# Altium schematic sheet Sheet1.SchDoc
size A; SheetNumber: 1; SheetTotal: 1
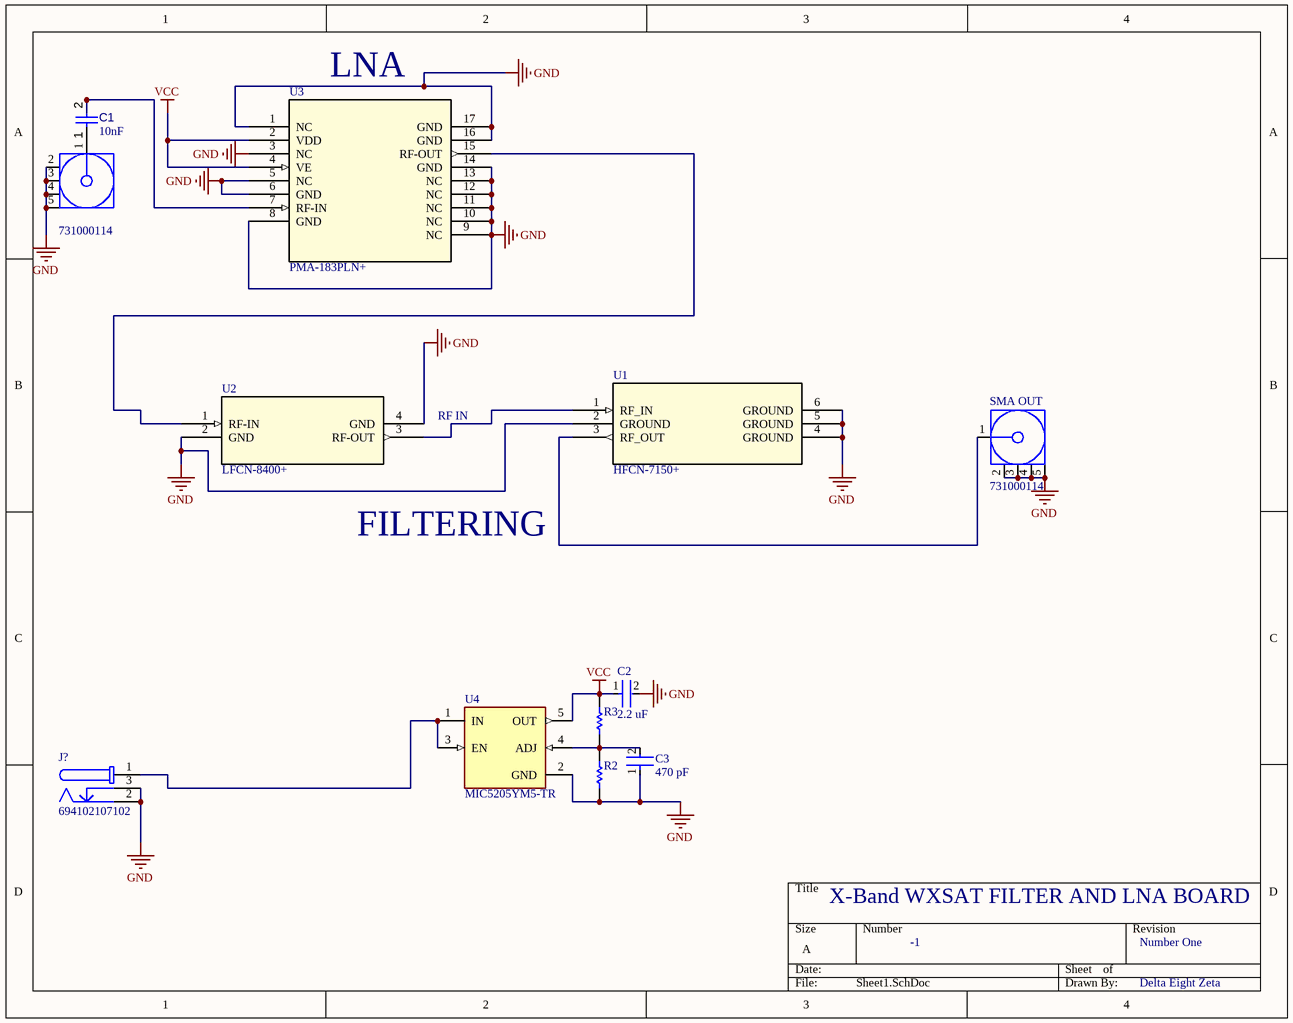
[diagram p0: Sheet1.SchDoc]

## Parts
?  731000114  [MOLX-731000114_V]
C1  value 10nF  [CAPC0402(1005)60_L]  (hidden comment: Capacitor 10nF +/-20% 50V 0402)
C2  2.2 uF  [FP-GRM188-0_1-e0_2_0_5-MFG]
C3  470 pF  [FP-0402-L_1_0_1-W_0_5_0_1-IPC_A]
J?  694102107102  [694102107102]
R2  (no value)  [RESC1005X40X25ML10T10]
R3  (no value)  [RESC2013X60X40LL20T25]
SMA_OUT  731000114  [MOLX-731000114_V]
U1  HFCN-7150+  [FV1206-1_MNC]
U2  LFCN-8400+  [FV1206-4_MNC]
U3  PMA-183PLN+  [JV2579_MNC]
U4  MIC5205YM5-TR  [FP-SOT23-5LD-PL-1-MFG]

## Nets
GND: ?.2 ?.3 ?.4 ?.5 C2.2 C3.1 J?.2 J?.3 R2.2 SMA_OUT.2 SMA_OUT.3 SMA_OUT.4 SMA_OUT.5 U1.2(GROUND) U1.4(GROUND) U1.5(GROUND) U1.6(GROUND) U2.2(GND) U2.4(GND) U3.1(NC) U3.3(NC) U3.5(NC) U3.6(GND) U3.8(GND) U3.9(NC) U3.10(NC) U3.11(NC) U3.12(NC) U3.13(NC) U3.14(GND) U3.16(GND) U3.17(GND) U4.2(GND)
VCC: C2.1 R3.1 U3.2(VDD) U3.4(VE) U4.5(OUT)
Net?_1: ?.1 C1.1
NetC1_2: C1.2 U3.7(RF-IN)
NetC3_2: C3.2 R2.1 R3.2 U4.4(ADJ)
NetJ?_1: J?.1 U4.1(IN) U4.3(EN)
NetSMA_OUT_1: SMA_OUT.1 U1.3(RF_OUT)
NetU1_1: U1.1(RF_IN) U2.3(RF-OUT)
NetU2_1: U2.1(RF-IN) U3.15(RF-OUT)

## Notes on the sheet
- (near U3) LNA
- RF IN
- FILTERING
- X-Band WXSAT FILTER AND LNA BOARD
- -1
- Number One
- Delta Eight Zeta

## Library data of the parts
? SMA_OUT = CMP-2000-05487-1: SMA Right-Angle PCB Jack Receptacle, Brass Body, Gold Plated, 50 Ohm, 5-Pin THD, RoHS, Tray; Manufacturer: Molex; Datasheet Version: 09/2016; Package Description: 5-Pin Through Hole Device, Body 14.8 x 6.35 mm, Pitch 2.54 mm; Datasheet URL: http://www.molex.com/webdocs/datasheets/pdf/en-us/0731000114_RF_COAX_CONNECTORS.pdf; Manufacturer URL: http://www.molex.com/; Package Reference: 731000114; Mounting Technology: ThroughHole; Package URL: http://www.molex.com/pdm_docs/sd/731000114_sd.pdf
C1 = CMP-001-00069-3: Chip Capacitor, 10nF +/-20%, 50V, 0402, Thickness 0.6 mm; Tolerance: 5%; Max Operating Temperature: 85°C; Pins: 2; Case/Package: 0402; Voltage Rating: 50V; Min Operating Temperature: -55°C; Mounting Technology: SMT
C2 = CMP-2006-02836-2: Chip Multilayer Ceramic Capacitors for General Purpose, 0603, 2.2uF, X7R, 15%, 10%, 10V; Case Code (Metric): 1608; Height: 0.8mm; Packaging: Cut Tape; Voltage: 10V; Lead Free: Lead Free; Min Operating Temperature: -55°C; Voltage Rating (DC): 10V; Max Operating Temperature: 125°C; Voltage Rating: 10V; Dielectric: X7R; Depth: 0.8mm; Case Code (Imperial): 0603; Termination: SMD/SMT; Case/Package: 0603; Number of Pins: 2; REACH SVHC: No SVHC; Mount: Surface Mount; Width: 0.031inch; Material: Ceramic; Capacitance: 2.2uF; Package Quantity: 1; Weight: 7.1E-05oz; Length: 1.6mm; Thickness: 0.035inch; Tolerance: 10%; Value: 2.2uF
C3 = CMP-1034-01502-3: General Purpose Ceramic Capacitor, 0402, 470pF, 10%, X7R, 15%, 50V; Series: -; Height: 0.5mm; Termination: SMD/SMT; Packaging: Tape and Reel; Tolerance: 10%; REACH SVHC: No SVHC; Package Quantity: 10000; Case Code (Imperial): 0402; Voltage: 50V; Depth: 0.5mm; Case Code (Metric): 1005; Voltage Rating: 50V; Radiation Hardening: No; Construction: Flat; Mount: Surface Mount; Dielectric: X7R; Min Operating Temperature: -55°C; Width: 0.5mm; Number of Pins: 2; Case/Package: 0402; RoHS Compliant: Yes; Thickness: 0.022inch; Lead Free: Lead Free; Voltage Rating (DC): 50V; Max Operating Temperature: 125°C; Capacitance: 470pF; Length: 1mm; Contact Plating: Tin; Value: 470pF
J? = CMP-1502-00174-2: NexarPartId: 52645180; Connector Type: Power; Insulation Resistance: 100MΩ; Gender: Male; Current Rating: 5A; Voltage Rating: 18V; Shielding: Unshielded; Mount: Surface Mount; Packaging: Tape and Reel; Max Operating Temperature: 85°C; Color: Black; Contact Plating: Tin; Min Operating Temperature: -40°C; Housing Material: Polyamide; Termination: SMD/SMT; RoHS: Compliant; Contact Gender: Female; REACH SVHC: Unknown; Voltage Rating (DC): 18V; Operating Supply Voltage: 18V; Flammability Rating: UL94 V-0
R2 = CMP-2002-05819-1: Part Number: ERA-2AEB621X; Manufacturer: Panasonic
R3 = CMP-2001-00628-1: Manufacturer: Panasonic; Part Number: ERA6AEB331V
U1 = HFCN-7150+: No Description Available; Mfr_Name: Mini Circuits; Copyright: Copyright (C) 2024 Ultra Librarian. All rights reserved.; Manufacturer_Part_Number: HFCN-7150+; RefDes: RefDes; Type: DEV
U2 = LFCN-8400+: No Description Available; Mfr_Name: Mini Circuits; Copyright: Copyright (C) 2024 Ultra Librarian. All rights reserved.; Manufacturer_Part_Number: LFCN-8400+; RefDes: RefDes; Type: DEV
U3 = PMA-183PLN+: No Description Available; Mfr_Name: Mini Circuits; Copyright: Copyright (C) 2024 Ultra Librarian. All rights reserved.; Manufacturer_Part_Number: PMA-183PLN+; RefDes: RefDes; Type: DEV
U4 = CMP-06324-000022-1: IC REG LIN POS ADJ 150MA SOT23-5; Manufacturer: Microchip; Output Type: AdjustableProgrammable; Number Of Outputs: 1; Max Supply Voltage: 16V; Min Supply Voltage: 2.5V; Nominal Supply Current: 80-1300uA; Dropout Voltage: 165mV; Standoff Height: 0mm; Accuracy Percentage: 1%; Max Junction Temp: +125°C; ComponentLink2URL: http://ww1.microchip.com/downloads/en/DeviceDoc/20005785A.pdf; Temperature Range Low: -40°C; Mouser Description: LDO Voltage Regulators 150mA 1% Low Noise LDO (Lead Free); Lead Free: Yes; Device Class L3: Voltage Regulators - Linear; Temperature: -40°C to +125°C; Device Class L1: Integrated Circuits (ICs); Automotive: No; Temperature Range High: +125°C; Manufacturer Part Number: MIC5205YM5-TR; RoHS: TRUE; Device Class L2: Power Management ICs; Output Current: 150mA; Package: SOT23-5LD-PL-1; Digikey Description: IC REG LIN POS ADJ 150MA SOT23-5; ComponentLink2Description: Datasheet; Category: IC; Octopart: https://octopart.com/mic5205ym5-tr-microchip-66802135; Height: 1.45mm